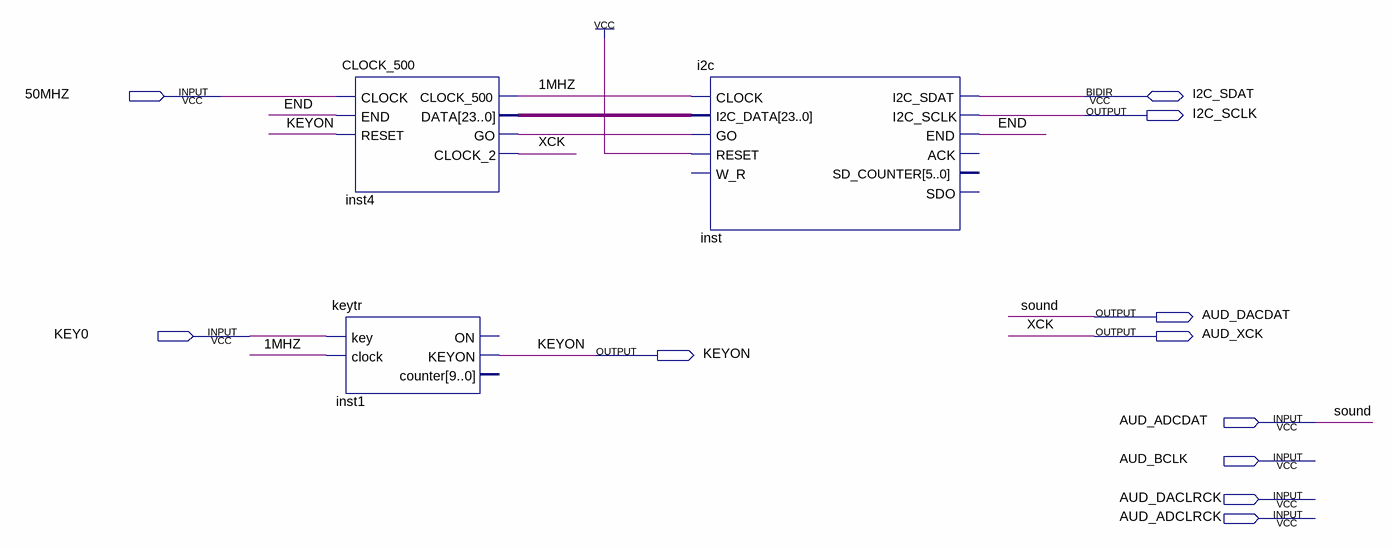
[diagram p0: schematic sheet]
// Quartus schematic DE2_i2sound.bdf as structural Verilog: 3 symbols, 11 pins
module DE2_i2sound (
  input  \50MHZ ,
  input  KEY0,
  input  AUD_ADCDAT,
  input  AUD_BCLK,
  input  AUD_DACLRCK,
  input  AUD_ADCLRCK,
  inout  I2C_SDAT,
  output I2C_SCLK,
  output AUD_DACDAT,
  output AUD_XCK,
  output KEYON
);

  wire \1MHZ , END, inst4_go;
  wire [23:0] inst4_data;

  CLOCK_500 inst4 (
    .CLOCK(\50MHZ ), .END(END), .RESET(KEYON), .CLOCK_500(\1MHZ ), .DATA(inst4_data), .GO(inst4_go),
    .CLOCK_2(AUD_XCK));
  keytr inst1 (.key(KEY0), .clock(\1MHZ ), .KEYON(KEYON));  // open: ON, counter
  i2c inst (
    .CLOCK(\1MHZ ), .I2C_DATA(inst4_data), .GO(inst4_go), .RESET(1'b1), .I2C_SCLK(I2C_SCLK), .END(END),
    .I2C_SDAT(I2C_SDAT));  // open: W_R, ACK, SD_COUNTER, SDO

  assign AUD_DACDAT = AUD_ADCDAT;

  // Other names for the same wires on the sheet: sound = AUD_ADCDAT; XCK = AUD_XCK
endmodule
